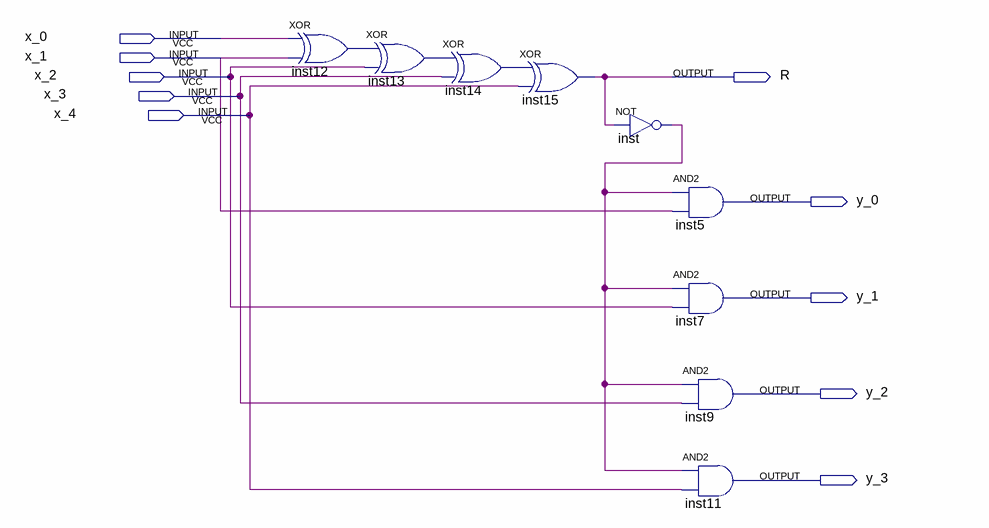
[diagram p0: schematic sheet]
// Quartus schematic decoding_p.bdf as structural Verilog: 9 symbols, 10 pins
module decoding_p (
  input  x_0,
  input  x_1,
  input  x_2,
  input  x_3,
  input  x_4,
  output R,
  output y_0,
  output y_1,
  output y_2,
  output y_3
);

  wire inst12_out, inst13_out, inst14_out, inst_out;

  xor inst12 (inst12_out, x_0, x_1);
  xor inst13 (inst13_out, inst12_out, x_2);
  xor inst14 (inst14_out, inst13_out, x_3);
  xor inst15 (R, inst14_out, x_4);
  not inst (inst_out, R);
  and inst5 (y_0, inst_out, x_1);
  and inst7 (y_1, inst_out, x_2);
  and inst9 (y_2, inst_out, x_3);
  and inst11 (y_3, inst_out, x_4);
endmodule
